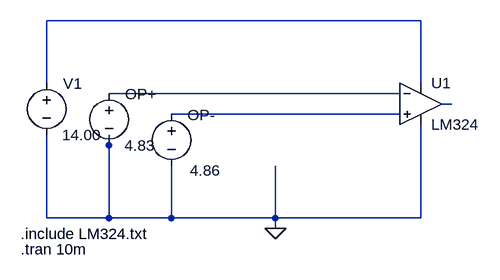
[diagram p0: schematic LM324.asc]
LM324.asc, the LTspice schematic file:
Version 4
SHEET 1 880 680
WIRE 464 208 -112 208
WIRE -112 304 -112 208
WIRE 464 304 464 208
WIRE 432 320 -16 320
WIRE 512 336 496 336
WIRE 432 352 80 352
WIRE -16 400 -16 384
WIRE -112 512 -112 384
WIRE -16 512 -16 400
WIRE -16 512 -112 512
WIRE 80 512 80 432
WIRE 80 512 -16 512
WIRE 240 512 240 432
WIRE 240 512 80 512
WIRE 464 512 464 368
WIRE 464 512 240 512
WIRE 240 528 240 512
FLAG 240 528 0
SYMBOL OpAmps/opamp2 464 272 R0
SYMATTR InstName U1
SYMATTR Value LM324
SYMBOL voltage -112 288 R0
WINDOW 0 25 17 Left 2
SYMATTR InstName V1
SYMATTR Value 14.00
SYMBOL voltage -16 304 R0
WINDOW 0 25 17 Left 2
SYMATTR InstName OP+
SYMATTR Value 4.83
SYMBOL voltage 80 336 R0
WINDOW 0 25 17 Left 2
WINDOW 3 29 103 Left 2
SYMATTR InstName OP-
SYMATTR Value 4.86
TEXT -152 560 Left 2 !.tran 10m
TEXT -152 536 Left 2 !.include LM324.txt

The netlist it stands for:
* LM324.asc
XU1 N004 N002 N001 0 N003 LM324  ; pins In+ In- V+ V- OUT
V1 N001 0 14.00
V§OP+ N002 0 4.83
V§OP- N004 0 4.86
.tran 10m
.include LM324.txt
.backanno
.end